# EAGLE schematic LightSensorWiring (EAGLE 7.6.0)
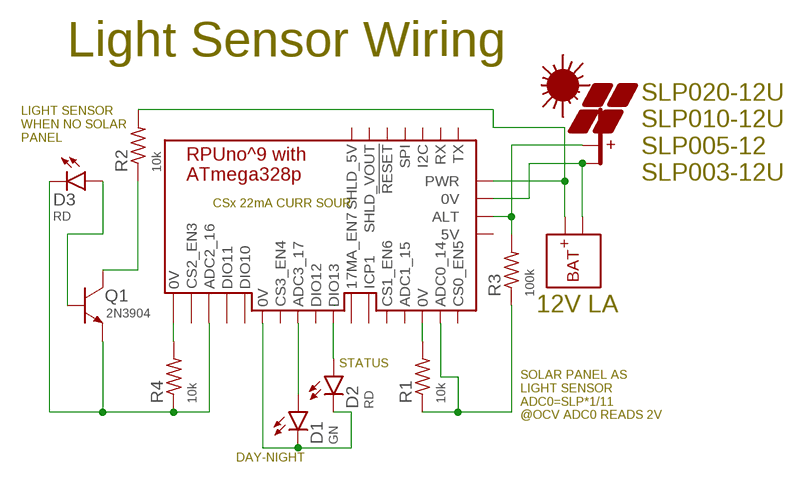
[diagram p0: schematic, sheet 1]

## Parts
BM1  RPUNO  [NA-30]
D1  GN  LED5MM  [LED5MM]
D2  RD  LED5MM  [LED5MM]
D3  RD  LED5MM  [LED5MM]
PV4  PV  [NA-30]
Q1  2N3904  NPNSOT23  [SOT23]
R1  10k  R0805  [C0805(2012)]
R2  10k  R0805  [C0805(2012)]
R3  100k  R0805  [C0805(2012)]
R4  10k  R0805  [C0805(2012)]
U$7  BAT  [NA-30]

## Nets
0V: BM1.9(0V) PV4.2(-PV) U$7.2(-BAT)
N$1: BM1.8(PWR) R2.2 U$7.1(+BAT)
N$2: BM1.26(0V) R1.2
N$3: BM1.28(0V) D1.K D2.K
N$4: D3.A Q1.B
N$5: BM1.13(ADC2_16) D3.K Q1.E R4.1
N$6: BM1.11(ADC0_14) R1.1 R3.1
N$7: Q1.C R2.1
N$8: BM1.27(0V) R4.2
N$28: BM1.18(DIO13) D2.A
N$29: BM1.16(ADC3_17) D1.A
N$34: BM1.20(ALT) PV4.1(+PV) R3.2
Unconnected: BM1.1(TX) BM1.2(RX) BM1.3(I2C) BM1.4(SPI) BM1.5(!RESET) BM1.6(SHLD_5V) BM1.7(SHLD_VOUT) BM1.10(ADC1_15) BM1.12(ICP1) BM1.14(DIO11) BM1.15(DIO10) BM1.17(DIO12) BM1.19(5V) BM1.21(17MA_EN7) BM1.22(CS1_EN6) BM1.23(CS0_EN5) BM1.24(CS2_EN3) BM1.29(CS3_EN4)

## Notes on the sheet
- Light Sensor Wiring
- LIGHT SENSOR
  WHEN NO SOLAR
  PANEL
- SLP020-12U
  SLP010-12U
  SLP005-12
  SLP003-12U
- 12V LA
- STATUS
- SOLAR PANEL AS 
  LIGHT SENSOR
  ADC0=SLP*1/11
  @OCV ADC0 READS 2V
- DAY-NIGHT

## Library data of the parts
BM1 = Documentation:RPUNO: BM /w 328p
D1-D3 = D-LED:LED: LED 120120WH [CREE,XHGAWT-00-0000-00000HXE1] LED WHITE 6500K 150LUM-W120120
PV4 = Documentation:PV
Q1 = Q-NPN:NPN: BJT NPN General Purpose Amplifier
R1-R4 = R-C:R: Resiistor American-style symbol
U$7 = Documentation:BAT